# EAGLE schematic TL431_VoltageSupply (EAGLE 7.6.0)
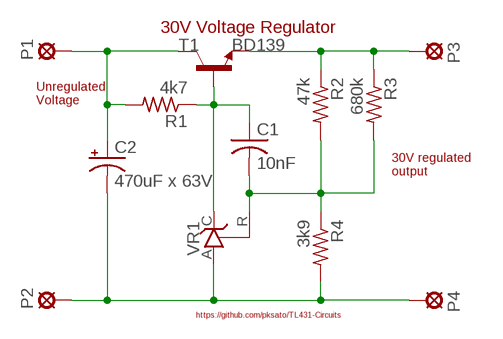
[diagram p0: schematic, sheet 1]

## Parts
C1  10nF  C-US050-024X044  [C050-024X044]
C2  470uF x 63V  CPOL-USE5-13  [E5-13]
P1  LSP10  [LSP10]
P2  LSP10  [LSP10]
P3  LSP10  [LSP10]
P4  LSP10  [LSP10]
R1  4k7  R-US_0207/10  [0207/10]
R2  47k  R-US_0207/10  [0207/10]
R3  680k  R-US_0207/10  [0207/10]
R4  3k9  R-US_0207/10  [0207/10]
T1  BD139  [TO126]
VR1  TL431CLP  [TO92-CLP]

## Nets
N$1: P3.MP R2.1 R3.1 T1.1(E)
N$2: C1.1 R1.1 T1.3(B) VR1.C
N$3: C1.2 R2.2 R3.2 R4.1 VR1.R
N$5: C2.+ P1.MP R1.2 T1.2(C)
N$6: C2.- P2.MP P4.MP R4.2 VR1.A

## Notes on the sheet
- 30V Voltage Regulator
- Unregulated
  Voltage
- 30V regulated
  output
- https://github.com/pksato/TL431-Circuits

## Library data of the parts
C1 = rcl:C-US: CAPACITOR, American symbol
C2 = rcl:CPOL-US: POLARIZED CAPACITOR, American symbol
P1-P4 = solpad:LSP10: SOLDER PAD drill 1.0 mm, distributor Buerklin, 12H555
R1-R4 = rcl:R-US_: RESISTOR, American symbol
T1 = transistor-neu-to92:BD139: NPN TRANSISTOR
VR1 = v-reg:TL431CLP: VOLTAGE REGULATOR